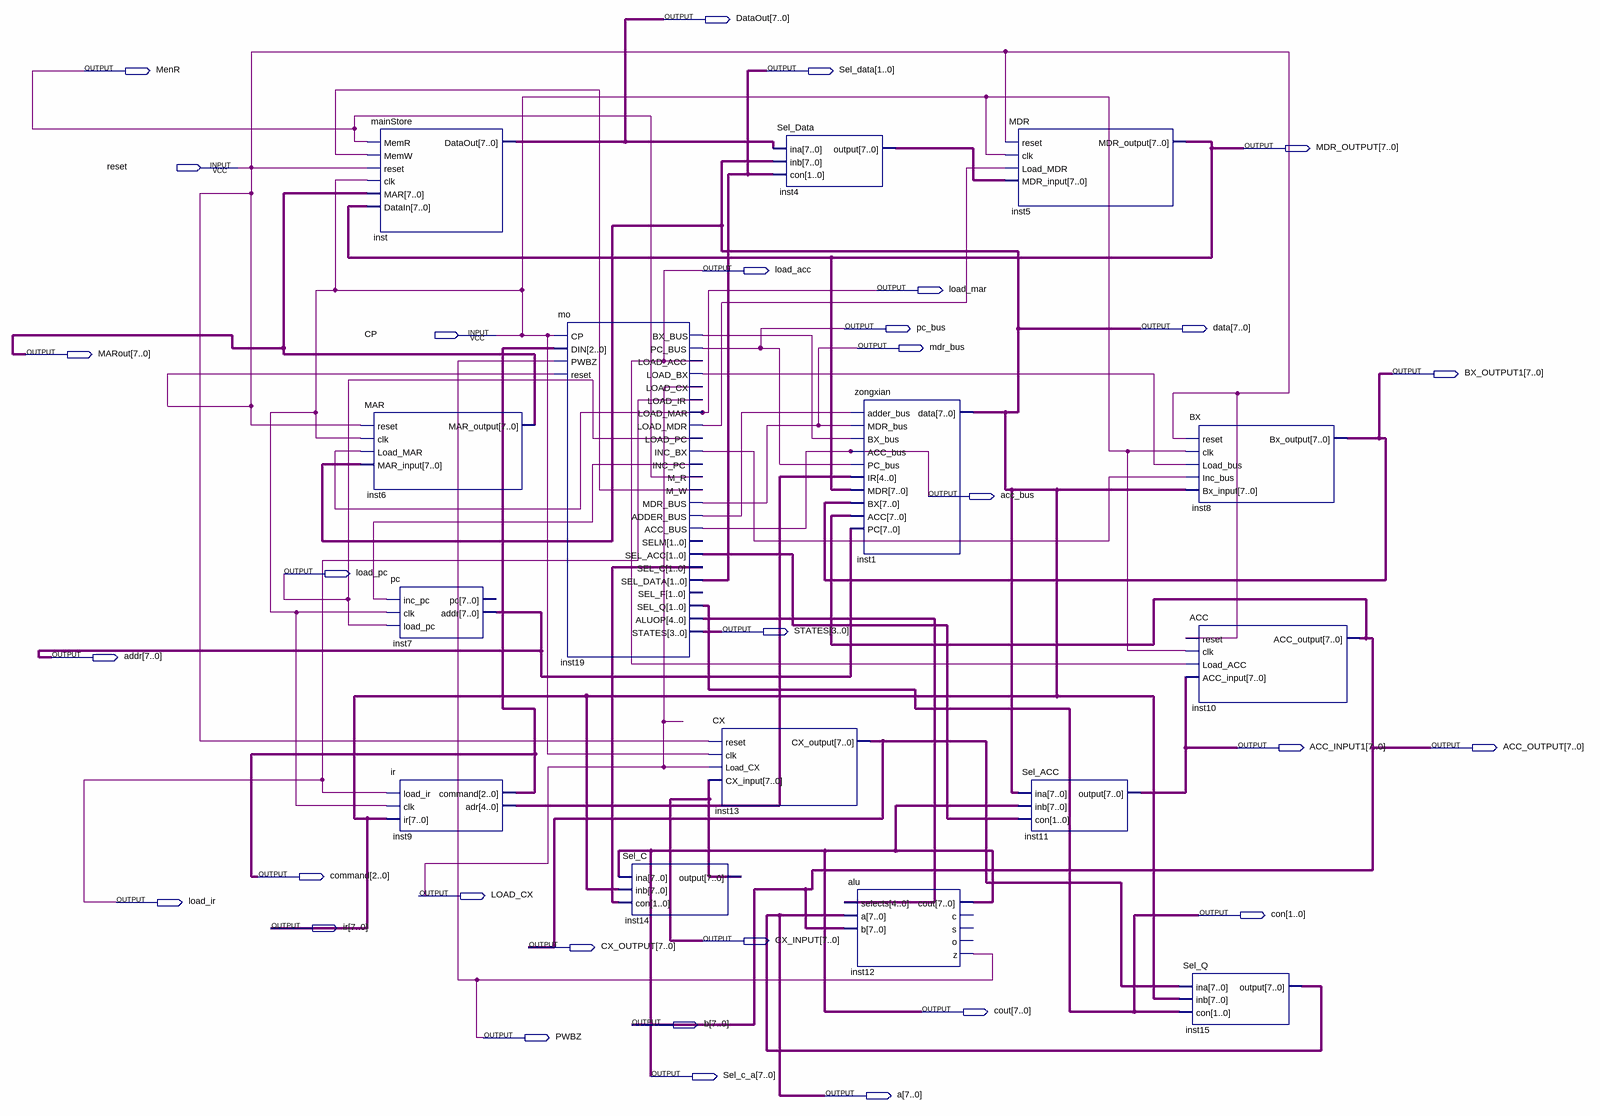
[diagram p0: schematic sheet]
// Quartus schematic main.bdf as structural Verilog: 15 symbols, 31 pins
module main (
  input  reset,
  input  CP,
  output [7:0] DataOut,
  output MenR,
  output [1:0] Sel_data,
  output [7:0] MDR_OUTPUT,
  output load_acc,
  output load_mar,
  output pc_bus,
  output [7:0] data,
  output mdr_bus,
  output [7:0] MARout,
  output [7:0] BX_OUTPUT1,
  output acc_bus,
  output load_pc,
  output [3:0] STATES,
  output [7:0] addr,
  output [7:0] ACC_INPUT1,
  output [7:0] ACC_OUTPUT,
  output [2:0] command,
  output LOAD_CX,
  output load_ir,
  output [1:0] con,
  output [7:0] ir,
  output [7:0] CX_INPUT,
  output [7:0] CX_OUTPUT,
  output [7:0] cout,
  output [7:0] b,
  output PWBZ,
  output [7:0] Sel_c_a,
  output [7:0] a
);

  wire inst19_adder_bus, inst19_bx_bus, inst19_inc_bx, inst19_inc_pc, inst19_load_bx, inst19_load_mdr,
       inst19_m_w;
  wire [1:0] inst19_sel_acc, inst19_sel_c;
  wire [4:0] inst9_adr, inst19_aluop;
  wire [7:0] inst4_output;

  mainStore inst (
    .MemR(MenR), .MemW(inst19_m_w), .reset(reset), .clk(CP), .MAR(MARout), .DataIn(MDR_OUTPUT),
    .DataOut(DataOut));
  MAR inst6 (.reset(reset), .clk(CP), .Load_MAR(load_mar), .MAR_input(data), .MAR_output(MARout));
  pc inst7 (.inc_pc(inst19_inc_pc), .clk(CP), .load_pc(load_pc), .addr(addr));  // open: pc
  ir inst9 (.load_ir(load_ir), .clk(CP), .ir(data), .command(command), .adr(inst9_adr));
  mo inst19 (
    .CP(CP), .DIN(command), .PWBZ(PWBZ), .reset(reset), .BX_BUS(inst19_bx_bus), .PC_BUS(pc_bus),
    .LOAD_ACC(load_acc), .LOAD_BX(inst19_load_bx), .LOAD_CX(LOAD_CX), .LOAD_IR(load_ir), .LOAD_MAR(load_mar),
    .LOAD_MDR(inst19_load_mdr), .LOAD_PC(load_pc), .INC_BX(inst19_inc_bx), .INC_PC(inst19_inc_pc),
    .M_R(MenR), .M_W(inst19_m_w), .MDR_BUS(mdr_bus), .ADDER_BUS(inst19_adder_bus), .ACC_BUS(acc_bus),
    .SEL_ACC(inst19_sel_acc), .SEL_C(inst19_sel_c), .SEL_DATA(Sel_data), .SEL_Q(con), .ALUOP(inst19_aluop),
    .STATES(STATES));  // open: SELM, SEL_F
  Sel_C inst14 (.ina(cout), .inb(data), .con(inst19_sel_c), .\output (CX_INPUT));
  CX inst13 (.reset(reset), .clk(CP), .Load_CX(LOAD_CX), .CX_input(CX_INPUT), .CX_output(CX_OUTPUT));
  Sel_Data inst4 (.ina(DataOut), .inb(data), .con(Sel_data), .\output (inst4_output));
  zongxian inst1 (
    .adder_bus(inst19_adder_bus), .MDR_bus(mdr_bus), .BX_bus(inst19_bx_bus), .ACC_bus(acc_bus),
    .PC_bus(pc_bus), .IR(inst9_adr), .MDR(MDR_OUTPUT), .BX(BX_OUTPUT1), .ACC(ACC_OUTPUT), .PC(addr),
    .data(data));
  alu inst12 (.selects(inst19_aluop), .a(a), .b(ACC_OUTPUT), .cout(cout), .z(PWBZ));  // open: c, s, o
  MDR inst5 (.reset(reset), .clk(CP), .Load_MDR(inst19_load_mdr), .MDR_input(inst4_output), .MDR_output(MDR_OUTPUT));
  Sel_ACC inst11 (.ina(data), .inb(cout), .con(inst19_sel_acc), .\output (ACC_INPUT1));
  BX inst8 (
    .reset(reset), .clk(CP), .Load_bus(inst19_load_bx), .Inc_bus(inst19_inc_bx), .Bx_input(data),
    .Bx_output(BX_OUTPUT1));
  ACC inst10 (.reset(reset), .clk(CP), .Load_ACC(load_acc), .ACC_input(ACC_INPUT1), .ACC_output(ACC_OUTPUT));
  Sel_Q inst15 (.ina(CX_OUTPUT), .inb(data), .con(con), .\output (a));

  assign b = ACC_OUTPUT;
  assign ir = data;
  assign Sel_c_a = cout;
endmodule
